# Altium project LED_Emergency_warning_lights.PrjPcb
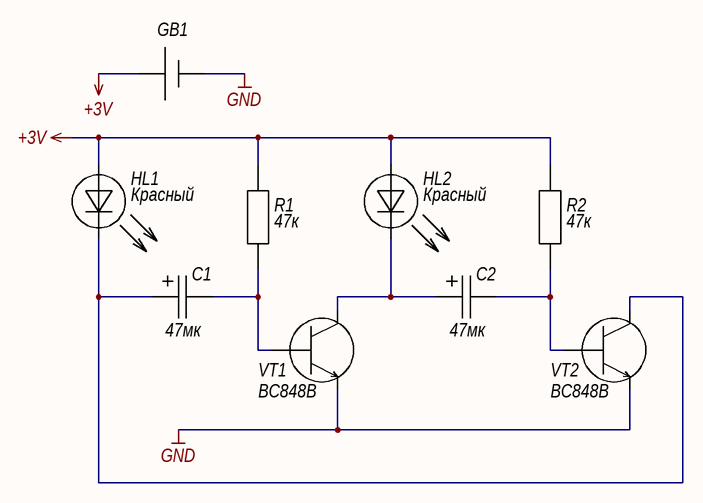
[diagram p0: LED_Emergency_warning_lights.SchDoc]
SheetTotal: 1; SheetNumber: 0; Name: Светодиодная аварийная сигнализация; DocumentType: Схема электрическая принципиальная; Author: Абрамов А.Д.; CompanyName3: Группа СМ5-42Б; CompanyName2: Кафедра СМ5; CompanyName1: МГТУ им. Н.Э. Баумана; CheckedBy: Перов А.Ю.
1 sheet, 9 parts. Net scope: global (net labels, ports and power ports of the same name join across sheets).
Board file: LED_Emergency_warning_lights.PcbDoc

## Sheet LED_Emergency_warning_lights.SchDoc
size 209 x 297 mm; SheetNumber: 1; SheetTotal: 1

### Parts
C1  47мк  [0607_ELECTR_CAP]
C2  47мк  [0607_ELECTR_CAP]
GB1  BA2032SM  [FP-653-MFG]  (value not drawn)
HL1  Красный  [0603_LED_RED]
HL2  Красный  [0603_LED_RED]
R1  47к  [0603_RES]
R2  47к  [0603_RES]
VT1  BC848B  [SOT-23]
VT2  BC848B  [SOT-23]

### Nets
+3V: GB1.P HL1.A HL2.A R1.1 R2.1
GND: GB1.N VT1.2(e) VT2.2(e)
NetC1_1: C1.1 HL1.K VT2.3(c)
NetC1_2: C1.2 R1.2 VT1.1(b)
NetC2_1: C2.1 HL2.K VT1.3(c)
NetC2_2: C2.2 R2.2 VT2.1(b)

### Notes on the sheet
- Перв.примен.
- Справ.№
- Подп. и дата
- Инв.№ дубл.
- Взам.инв.№
- Подп.и дата
- Разраб.
- Изм.
- Лист
- № докум.
- Подп.
- Дата
- Лит.
- Масштаб
- Масса
- Т.контр.
- Пров.
- Листов
- Инв.№ подл.
- Утв.
- Н.контр.
- Нач.сект.
- Копировал
- Формат  A4

### Library data of the parts
C1 C2 = Capacitor_pol: Tolerance: 20%; ValueDescription: Конденсатор полярный 0607 47мкФ±20% 35 В; ValueType: Конденсатор полярный; Voltage: 35; Case: 0607; Value: 47мк
GB1 = Battery: ValueManufacturer: MPD; ValueDescription: Батарейный отсек BA2032SM Каталог MPD; ValueType: Батарейный отсек; Value: BA2032SM; ValueManufacturerPartNumber: BA2032SM
HL1 HL2 = Led_red: ValueManufacturer: Foryard; ValueManufacturerPartNumber: FYLS-0603URC; Temp: -40C...+85C; ValueDescription: Светодиод FYLS-0603URC Каталог Foryard; ValueType: Светодиод; Case: 0603; Value: Красный
R1 R2 = Resistor: ValueManufacturerPartNumber: RC0603FR-0747KL; Tolerance: 1%; Power: 0,1; ValueDescription: Резистор 0603 47кОм ±1% 0,1 Вт; ValueType: Резистор; Case: 0603; Value: 47к
VT1 VT2 = NPN_BEC: ValueManufacturer: Nexperia B.V.; ValueManufacturerPartNumber: BC848B,215; ValueDescription: Биполярный транзистор BC848B,215 Каталог Nexperia B.V.; ValueType: Биполярный транзистор; Case: SOT-23; Value: BC848B